# EAGLE design 1_lowpass (EAGLE 6.5.0)
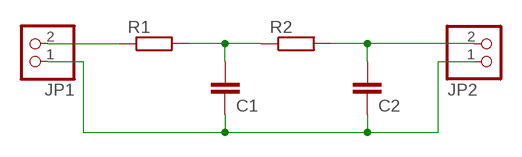
[diagram p0: schematic, sheet 1]

## Parts
C1  C-EUC1206  [C1206]
C2  C-EUC1206  [C1206]
JP1  PINHD-1X2  [1X02]
JP2  PINHD-1X2  [1X02]
R1  R-EU_M1206  [M1206]
R2  R-EU_M1206  [M1206]

## Nets
N$1: JP1.2 R1.1
N$2: C1.1 C2.1 JP1.1 JP2.1
N$3: C2.2 JP2.2 R2.2
N$4: C1.2 R1.2 R2.1

## Library data of the parts
C1 C2 = rcl:C-EU: CAPACITOR, European symbol
JP1 JP2 = pinhead:PINHD-1X2: PIN HEADER
R1 R2 = rcl:R-EU_: RESISTOR, European symbol

## Board
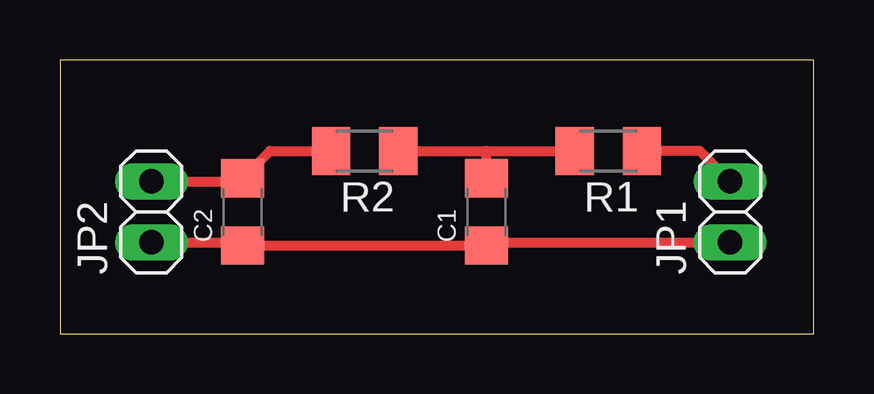
[diagram p1: board, top side]

Size 31.42 x 11.42 mm. Coordinates in mm from the lower left corner, seen from the top.
Outline: 0,0 31.42,0 31.42,11.42 0,11.42 0,0
Copper layers (1*16): Top 0.035mm / dielectric 1.5mm / Bottom 0.035mm
Design rules "default": minimum track width 10mil, minimum drill 24mil, track to track 8mil, track to pad 8mil, pad to pad 8mil, via to via 8mil, smd to smd 8mil, copper to edge 40mil, drill to drill 8mil, minimum pad ring 10mil, minimum via ring 8mil, stop-mask expansion 4mil, vias tented up to drill 0mil, thermal gap 10mil

### Footprints (pad centres in the part's own frame; a part is rotated, then mirrored left to right if it is on the bottom)
C1206 = smd 1.6 x 1.8: 1 -1.4,0; 2 1.4,0
1X02 = drill 1.016 long: 1 -1.27,0; 2 1.27,0
M1206 = smd 1.6 x 2: 1 -1.4,0; 2 1.4,0

### Placement (x,y rotation side)
C1  17.78,5.08 90 top
C2  7.62,5.08 90 top
JP1  27.94,5.08 90 top
JP2  3.81,5.08 90 top
R1  22.86,7.62 180 top
R2  12.7,7.62 180 top

### Tracks (layer width: path | path; a pad name or v marks a point on that pad's centre or on a via)
N$1
  Top 0.406: JP1.2 26.67,7.62 R1.1
N$2
  Top 0.406: JP2.1 7.49,3.81 C2.1 C1.1 17.91,3.81 JP1.1
N$3
  Top 0.406: JP2.2 7.62,6.35 C2.2 8.76,7.62 R2.2
N$4
  Top 0.406: R2.1 17.78,7.62 | 17.78,7.62 R1.2 | C1.2 17.78,7.62